# EAGLE schematic testproject (EAGLE 9.6.0)
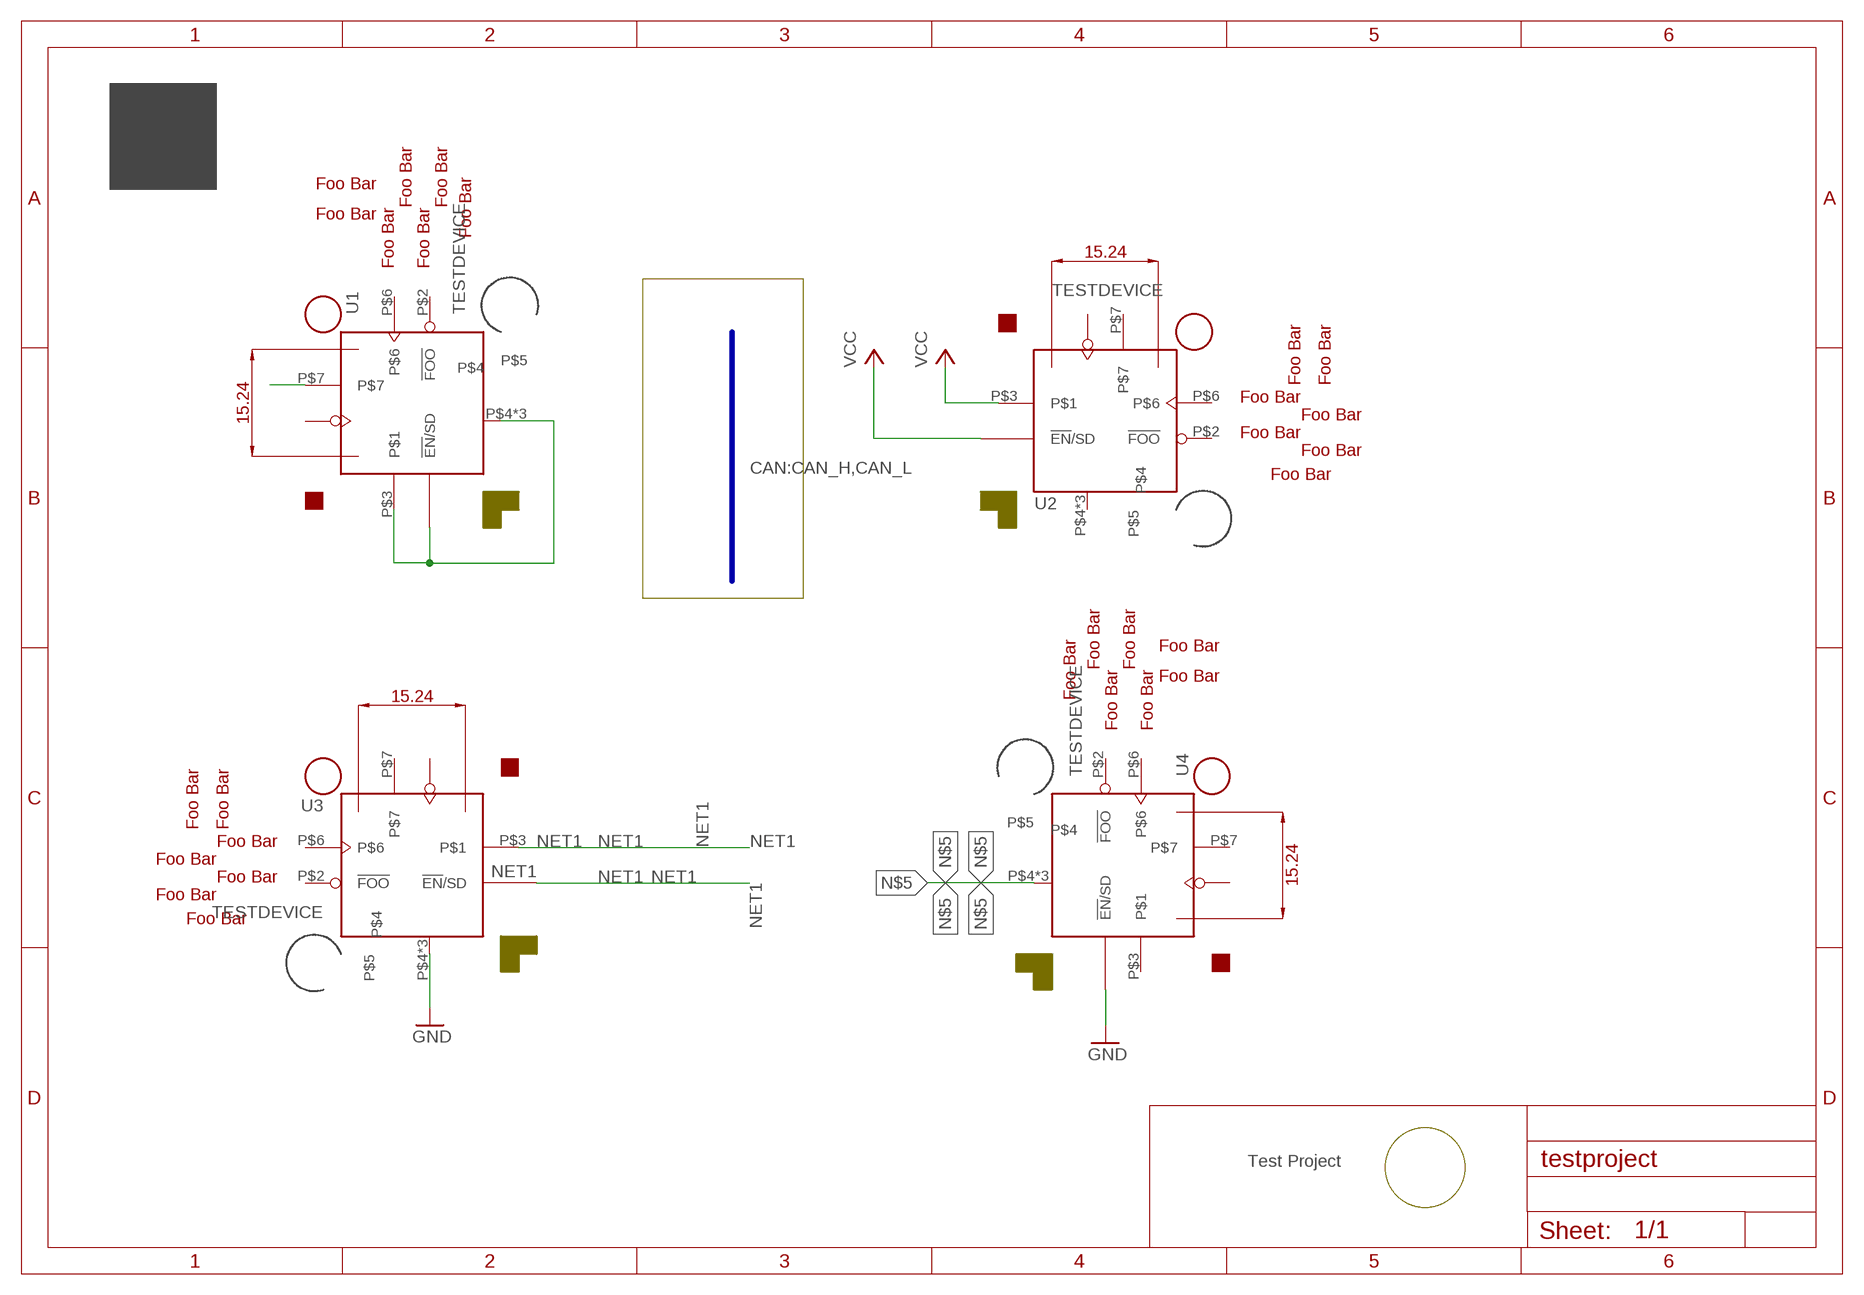
[diagram p0: schematic, sheet 1]

## Parts
U1  TESTDEVICE  [TESTPACKAGE]
U2  TESTDEVICE  [TESTPACKAGE]
U3  TESTDEVICE  [TESTPACKAGE]
U4  TESTDEVICE  [TESTPACKAGE]

## Nets
GND: U3.P$4 U3.P$13 U3.P$16 U4.P$1(!EN!/SD)
N$1: U1.P$1(!EN!/SD) U1.P$3 U1.P$4 U1.P$13 U1.P$16
N$2: U1.P$7
N$5: U4.P$4 U4.P$13 U4.P$16
NET1: U3.P$1(!EN!/SD) U3.P$3
VCC: U2.P$1(!EN!/SD) U2.P$3
Unconnected: U1.P$2(!FOO) U1.P$5 U1.P$6 U1.P$8 U1.P$9 U1.P$10 U2.P$2(!FOO) U2.P$4 U2.P$5 U2.P$6 U2.P$7 U2.P$8 U2.P$9 U2.P$10 U2.P$13 U2.P$16 U3.P$2(!FOO) U3.P$5 U3.P$6 U3.P$7 U3.P$8 U3.P$9 U3.P$10 U4.P$2(!FOO) U4.P$3 U4.P$5 U4.P$6 U4.P$7 U4.P$8 U4.P$9 U4.P$10

## Buses
CAN:CAN_H,CAN_L

## Notes on the sheet
- Test Project

## Library data of the parts
U1-U4 = librepcb:TESTDEVICE: A test device